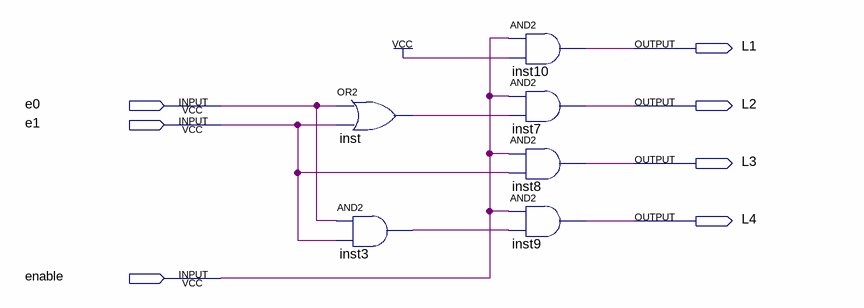
[diagram p0: schematic sheet]
// Quartus schematic lampsequence.bdf as structural Verilog: 6 symbols, 7 pins
module lampsequence (
  input  e0,
  input  e1,
  input  enable,
  output L1,
  output L2,
  output L3,
  output L4
);

  wire inst3_out, inst_out;

  or inst (inst_out, e0, e1);
  and inst3 (inst3_out, e0, e1);
  and inst10 (L1, enable, 1'b1);
  and inst7 (L2, enable, inst_out);
  and inst8 (L3, enable, e1);
  and inst9 (L4, enable, inst3_out);
endmodule
